# Altium schematic sheet ETHERNET.SchDoc
size 558 x 431 mm; SheetNumber: 17; SheetTotal: 25; Sheet_Name: Ethernet; Size: 11x17
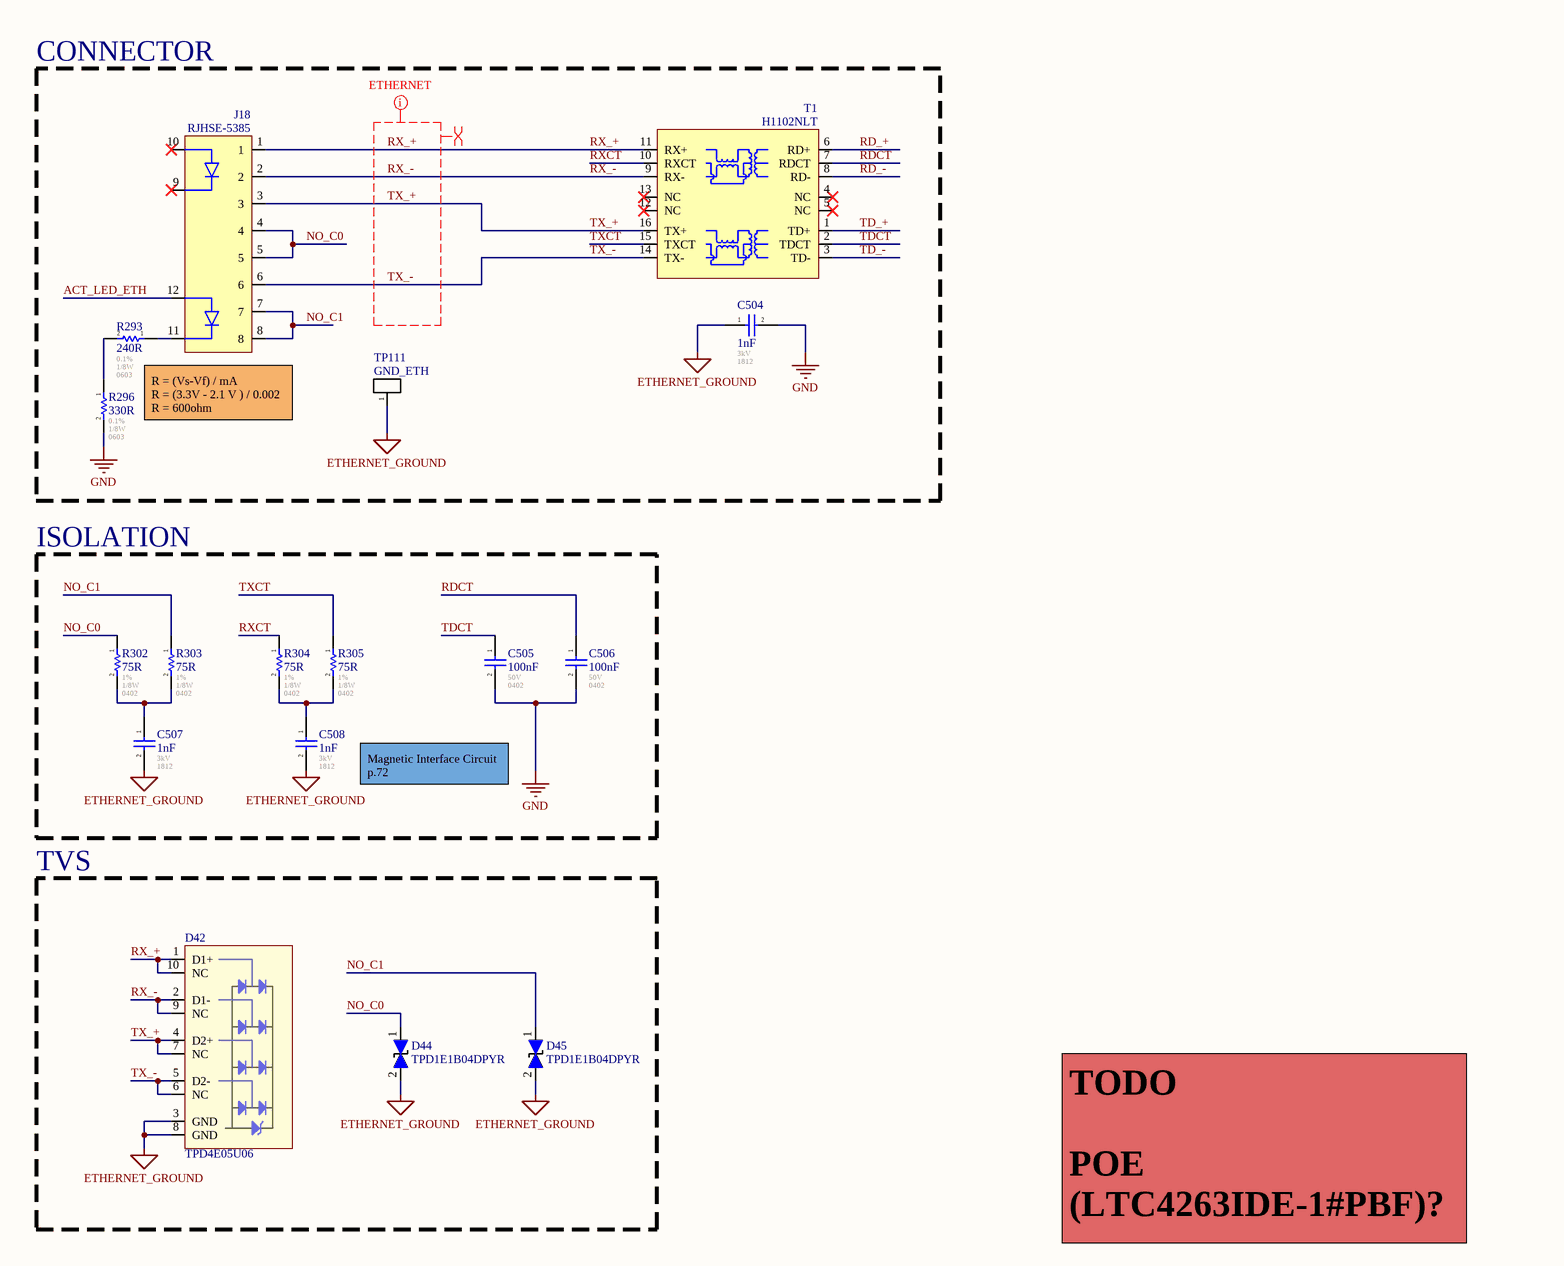
[diagram p0: ETHERNET.SchDoc, top left]
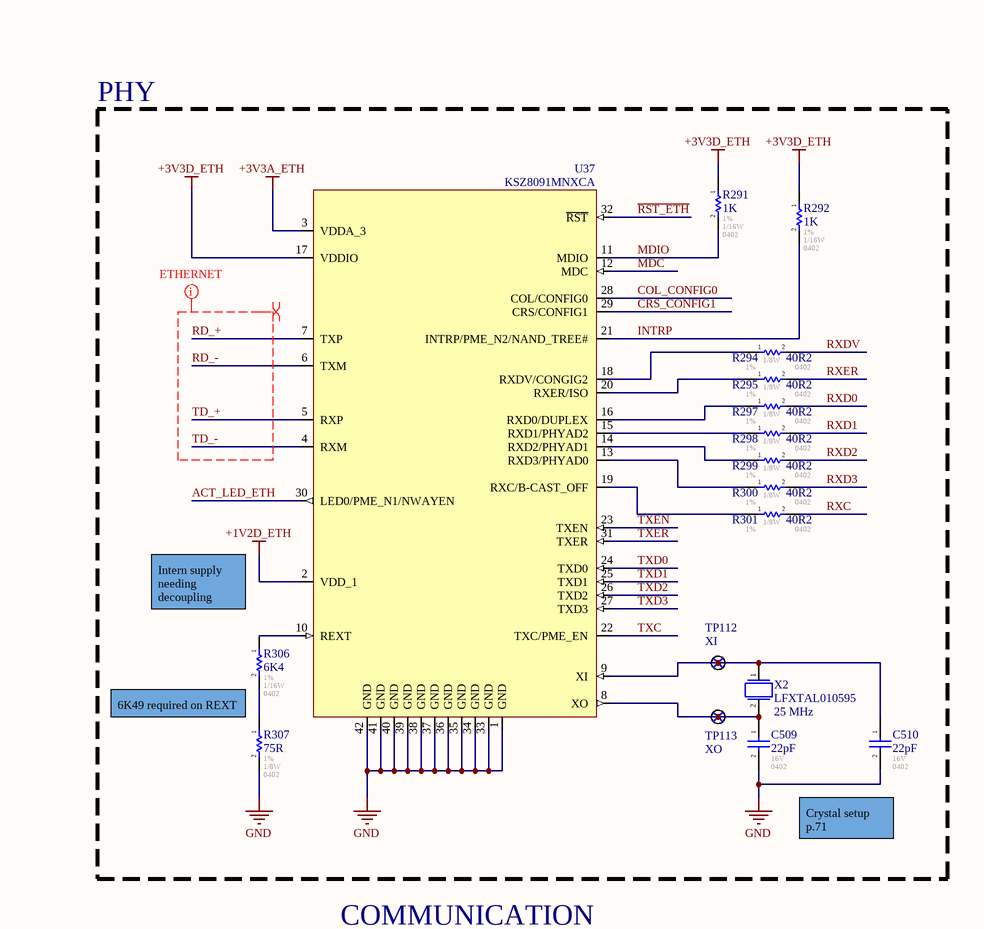
[diagram p1: ETHERNET.SchDoc, top right]
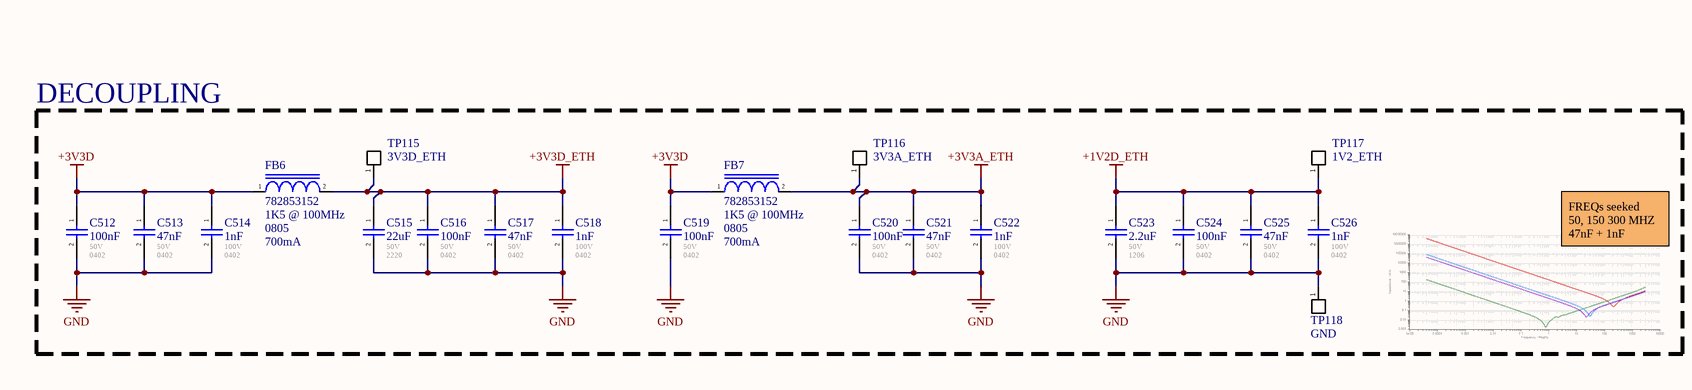
[diagram p2: ETHERNET.SchDoc, bottom left]
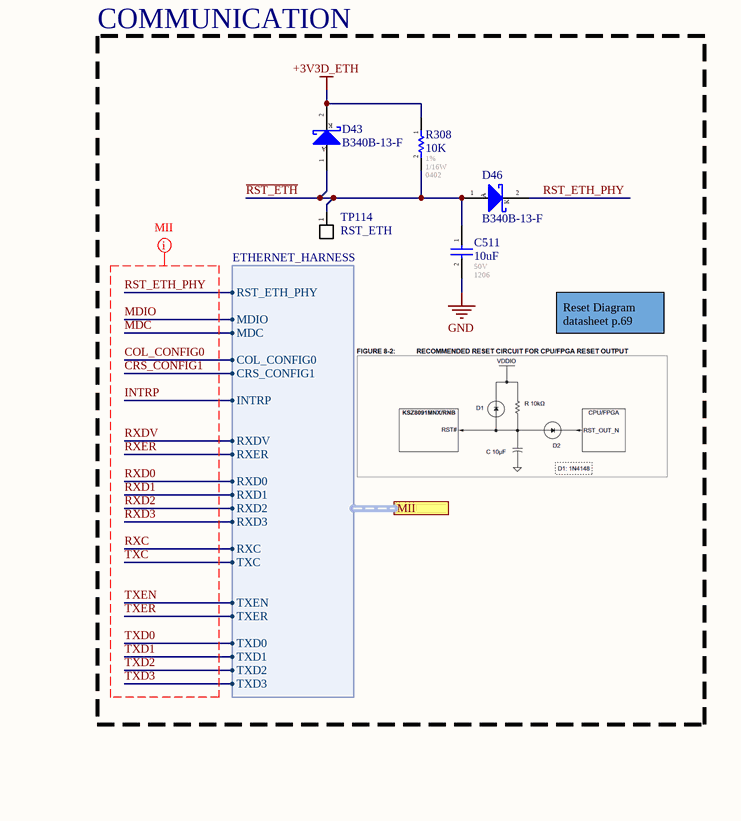
[diagram p3: ETHERNET.SchDoc, bottom right]

## Parts
C504  1nF  Voltage - Rated: 3kV  Footprint: 1812  [CAP_1812]
C505  100nF  Voltage - Rated: 50V  Footprint: 0402  [CAP_0402]
C506  100nF  Voltage - Rated: 50V  Footprint: 0402  [CAP_0402]
C507  1nF  Voltage - Rated: 3kV  Footprint: 1812  [CAP_1812]
C508  1nF  Voltage - Rated: 3kV  Footprint: 1812  [CAP_1812]
C509  22pF  Voltage - Rated: 16V  Footprint: 0402  [CAP_0402]
C510  22pF  Voltage - Rated: 16V  Footprint: 0402  [CAP_0402]
C511  10uF  Voltage - Rated: 50V  Footprint: 1206  [CAP_1206]
C512  100nF  Voltage - Rated: 50V  Footprint: 0402  [CAP_0402]
C513  47nF  Voltage - Rated: 50V  Footprint: 0402  [CAP_0402]
C514  1nF  Voltage - Rated: 100V  Footprint: 0402  [CAP_0402]
C515  22uF  Voltage - Rated: 50V  Footprint: 2220  [CAP_2220]
C516  100nF  Voltage - Rated: 50V  Footprint: 0402  [CAP_0402]
C517  47nF  Voltage - Rated: 50V  Footprint: 0402  [CAP_0402]
C518  1nF  Voltage - Rated: 100V  Footprint: 0402  [CAP_0402]
C519  100nF  Voltage - Rated: 50V  Footprint: 0402  [CAP_0402]
C520  100nF  Voltage - Rated: 50V  Footprint: 0402  [CAP_0402]
C521  47nF  Voltage - Rated: 50V  Footprint: 0402  [CAP_0402]
C522  1nF  Voltage - Rated: 100V  Footprint: 0402  [CAP_0402]
C523  2.2uF  Voltage - Rated: 50V  Footprint: 1206  [CAP_1206]
C524  100nF  Voltage - Rated: 50V  Footprint: 0402  [CAP_0402]
C525  47nF  Voltage - Rated: 50V  Footprint: 0402  [CAP_0402]
C526  1nF  Voltage - Rated: 100V  Footprint: 0402  [CAP_0402]
D42  TPD4E05U06  [TVS_DATA_TPD4E05U06]
D43  B340B-13-F  [DO214AA (SMB)]
D44  TPD1E1B04DPYR  [TVS_DATA_TPD1E1B04DPYR]
D45  TPD1E1B04DPYR  [TVS_DATA_TPD1E1B04DPYR]
D46  B340B-13-F  [DO214AA (SMB)]
FB6  782853152  Impedance @ Freq: 1K5 @ 100MHz  Package / Case: 0805  Current Rating: 700mA  [IND_0805]
FB7  782853152  Impedance @ Freq: 1K5 @ 100MHz  Package / Case: 0805  Current Rating: 700mA  [IND_0805]
J18  RJHSE-5385  [CONN_ETHERNET_RJHSE-5385]
R291  1K  Tolerance: 1%  Power: 1/16W  Package / Case: 0402  [RES_0402]
R292  1K  Tolerance: 1%  Power: 1/16W  Package / Case: 0402  [RES_0402]
R293  240R  Tolerance: 0.1%  Power: 1/8W  Package / Case: 0603  [RES_0603]
R294  40R2  Tolerance: 1%  Power: 1/8W  Package / Case: 0402  [RES_0402]
R295  40R2  Tolerance: 1%  Power: 1/8W  Package / Case: 0402  [RES_0402]
R296  330R  Tolerance: 0.1%  Power: 1/8W  Package / Case: 0603  [RES_0603]
R297  40R2  Tolerance: 1%  Power: 1/8W  Package / Case: 0402  [RES_0402]
R298  40R2  Tolerance: 1%  Power: 1/8W  Package / Case: 0402  [RES_0402]
R299  40R2  Tolerance: 1%  Power: 1/8W  Package / Case: 0402  [RES_0402]
R300  40R2  Tolerance: 1%  Power: 1/8W  Package / Case: 0402  [RES_0402]
R301  40R2  Tolerance: 1%  Power: 1/8W  Package / Case: 0402  [RES_0402]
R302  75R  Tolerance: 1%  Power: 1/8W  Package / Case: 0402  [RES_0402]
R303  75R  Tolerance: 1%  Power: 1/8W  Package / Case: 0402  [RES_0402]
R304  75R  Tolerance: 1%  Power: 1/8W  Package / Case: 0402  [RES_0402]
R305  75R  Tolerance: 1%  Power: 1/8W  Package / Case: 0402  [RES_0402]
R306  6K4  Tolerance: 1%  Power: 1/16W  Package / Case: 0402  [RES_0402]
R307  75R  Tolerance: 1%  Power: 1/8W  Package / Case: 0402  [RES_0402]
R308  10K  Tolerance: 1%  Power: 1/16W  Package / Case: 0402  [RES_0402]
T1  H1102NLT  [TRANSFO_H1102NLT]
TP111  GND_ETH  [TP_HOLE]  (no BOM)
TP112  XI  [TP_PAD_TINY]  (no BOM)
TP113  XO  [TP_PAD_TINY]  (no BOM)
TP114  RST_ETH  [TP_PAD]  (no BOM)
TP115  3V3D_ETH  [TP_PAD]  (no BOM)
TP116  3V3A_ETH  [TP_PAD]  (no BOM)
TP117  1V2_ETH  [TP_PAD]  (no BOM)
TP118  GND  [TP_PAD]  (no BOM)
U37  KSZ8091MNXCA  [COM_ETH_PHY_KSZ8091MNXCA]
X2  LFXTAL010595  Frequency: 25 MHz  [HC49_SMD]

## Blocks framed on the sheet
CONNECTOR: C504 J18 R293 R296 T1 TP111
PHY: C509 C510 R291 R292 R294 R295 R297-R301 R306 R307 TP112 TP113 U37 X2
ISOLATION: C505-C508 R302-R305
TVS: D42 D44 D45
COMMUNICATION: C511 D43 D46 R308 TP114
DECOUPLING: C512-C526 FB6 FB7 TP115-TP118

## Ports
MII (harness ETHERNET_HARNESS)

## Harnesses
ETHERNET_HARNESS: MDIO, MDC, COL_CONFIG0, CRS_CONFIG1, INTRP, RXDV, RXER, RXD0, RXD1, RXD2, RXD3, RXC, TXEN, TXER, TXD0, TXD1, TXD2, TXD3, TXC, RST_ETH_PHY

## Nets
+1V2D_ETH: C523.1 C524.1 C525.1 C526.1 TP117.1(A) U37.2(VDD_1)
+3V3A_ETH: C520.1 C521.1 C522.1 FB7.2 TP116.1(A) U37.3(VDDA_3)
+3V3D: C512.1 C513.1 C514.1 C519.1 FB6.1 FB7.1
+3V3D_ETH: C515.1 C516.1 C517.1 C518.1 D43.2(K) FB6.2 R291.1 R292.1 R308.1 TP115.1(A) U37.17(VDDIO)
ETHERNET_GROUND: C504.1 C507.2 C508.2 D42.3(GND) D42.8(GND) D44.2(i/o) D45.2(i/o) TP111.1(A)
GND: C504.2 C505.2 C506.2 C509.2 C510.2 C511.2 C512.2 C513.2 C514.2 C515.2 C516.2 C517.2 C518.2 C519.2 C520.2 C521.2 C522.2 C523.2 C524.2 C525.2 C526.2 R296.2 R307.2 TP118.1(A) U37.1(GND) U37.33(GND) U37.34(GND) U37.35(GND) U37.36(GND) U37.37(GND) U37.38(GND) U37.39(GND) U37.40(GND) U37.41(GND) U37.42(GND)
~{RST_ETH}: C511.1 D43.1(A) D46.1(A) R308.2 TP114.1(A) U37.32(~{RST})
ACT_LED_ETH: J18.12(LED2_A) U37.30(LED0/PME_N1/NWAYEN)
COL_CONFIG0: U37.28(COL/CONFIG0) ; port MII.COL_CONFIG0
CRS_CONFIG1: U37.29(CRS/CONFIG1) ; port MII.CRS_CONFIG1
INTRP: R292.2 U37.21(INTRP/PME_N2/NAND_TREE#) ; port MII.INTRP
MDC: U37.12(MDC) ; port MII.MDC
MDIO: R291.2 U37.11(MDIO) ; port MII.MDIO
NO_C0: D44.1(i/o) J18.4 J18.5 R302.1
NO_C1: D45.1(i/o) J18.7 J18.8 R303.1
RD_+: T1.6(RD+) U37.7(TXP)
RD_-: T1.8(RD-) U37.6(TXM)
RDCT: C506.1 T1.7(RDCT)
RST_ETH_PHY: D46.2(K) ; port MII.RST_ETH_PHY
RX_+: D42.1(D1+) D42.10(NC) J18.1 T1.11(RX+)
RX_-: D42.2(D1-) D42.9(NC) J18.2 T1.9(RX-)
RXC: R301.2 ; port MII.RXC
RXCT: R304.1 T1.10(RXCT)
RXD0: R297.2 ; port MII.RXD0
RXD1: R298.2 ; port MII.RXD1
RXD2: R299.2 ; port MII.RXD2
RXD3: R300.2 ; port MII.RXD3
RXDV: R294.2 ; port MII.RXDV
RXER: R295.2 ; port MII.RXER
TD_+: T1.1(TD+) U37.5(RXP)
TD_-: T1.3(TD-) U37.4(RXM)
TDCT: C505.1 T1.2(TDCT)
TX_+: D42.4(D2+) D42.7(NC) J18.3 T1.16(TX+)
TX_-: D42.5(D2-) D42.6(NC) J18.6 T1.14(TX-)
TXC: U37.22(TXC/PME_EN) ; port MII.TXC
TXCT: R305.1 T1.15(TXCT)
TXD0: U37.24(TXD0) ; port MII.TXD0
TXD1: U37.25(TXD1) ; port MII.TXD1
TXD2: U37.26(TXD2) ; port MII.TXD2
TXD3: U37.27(TXD3) ; port MII.TXD3
TXEN: U37.23(TXEN) ; port MII.TXEN
TXER: U37.31(TXER) ; port MII.TXER
NetC507_1: C507.1 R302.2 R303.2
NetC508_1: C508.1 R304.2 R305.2
NetC509_1: C509.1 TP113.1(A) U37.8(XO) X2.2
NetC510_1: C510.1 TP112.1(A) U37.9(XI) X2.1
NetJ18_11: J18.11(LED2_K) R293.1
NetR293_2: R293.2 R296.1
NetR294_1: R294.1 U37.18(RXDV/CONGIG2)
NetR295_1: R295.1 U37.20(RXER/ISO)
NetR297_1: R297.1 U37.16(RXD0/DUPLEX)
NetR298_1: R298.1 U37.15(RXD1/PHYAD2)
NetR299_1: R299.1 U37.14(RXD2/PHYAD1)
NetR300_1: R300.1 U37.13(RXD3/PHYAD0)
NetR301_1: R301.1 U37.19(RXC/B-CAST_OFF)
NetR306_1: R306.1 U37.10(REXT)
NetR306_2: R306.2 R307.1

Not connected (* = marked no-connect by the designer): J18 9(LED1_K)* 10(LED1_A)*; T1 4(NC)* 5(NC)* 12(NC)* 13(NC)*

## Layout directives
differential pair: RD_+, RD_-, RX_+, RX_-, TD_+, TD_-, TX_+, TX_-
net class ETHERNET: RD_+, RD_-, RX_+, RX_-, TD_+, TD_-, TX_+, TX_-
net class MII; net class S50: COL_CONFIG0, CRS_CONFIG1, INTRP, MDC, MDIO, RST_ETH_PHY, RXC, RXD0, RXD1, RXD2, RXD3, RXDV, RXER, TXC, TXD0, TXD1, TXD2, TXD3, TXEN, TXER

## Notes on the sheet
- R = (Vs-Vf) / mA
  R = (3.3V - 2.1 V ) / 0.002
  R = 600ohm
- Intern supply needing decoupling
- 6K49 required on REXT
- Magnetic Interface Circuit
  p.72
- Crystal setup
  p.71
- TODO
  POE
  (LTC4263IDE-1#PBF)?
- Reset Diagram
  datasheet p.69
- FREQs seeked
  50, 150 300 MHZ
  47nF + 1nF
- Sheet Name
- Project Title
- Global Project
- Revision
- Size
- Date
- Group
- Sheet
- of
- Filename
- Designers

## Library data of the parts
C504 C507 C508 = CAP_CER: C1812C102KHRACAUTO / 0402 470pF 10% X7R Ceramic Capacitor; Mfr: KEMET; Operating Temperature: -55C - 125C; Temperature Coefficient: X7R; ComponentLink1Description: Digikey; ComponentLink1URL: https://www.digikey.com/en/products/detail/kemet/C1812C102KHRACAUTO/8109956; Part#: C1812C102KHRACAUTO; ComponentLink2Description: Datasheet; ComponentLink2URL: https://connect.kemet.com:7667/gateway/IntelliData-ComponentDocumentation/1.0/download/datasheet/C1812C102KHRACAUTO; Tolerance: 10%; Ratings: AEC-Q200; ComponentLink3Description: KEMET; ComponentLink3URL: https://www.kemet.com/en/us/capacitors/ceramic/product/C1812C102KHRACAUTO.html; ComponentLink4Description: Octopart; ComponentLink4URL: https://octopart.com/c1812c102khracauto-kemet-67309371?r=sp; Features: Low ESL, High Voltage; Supplier 1: Mouser; Supplier Part Number 1: 80-C1812C102KHRAUTO
C505 C506 C512 C516 C519 C520 C524 = CAP_CER: GCM155R71H104KE02J / 0402 100nF 10% X7R Ceramic Capacitor; Mfr: Murata; Operating Temperature: -55C - 125C; Temperature Coefficient: X7R; ComponentLink1Description: Digikey; ComponentLink1URL: [Digikey Link]; Part#: GCM155R71H104KE02J; ComponentLink2Description: Datasheet; ComponentLink2URL: [Datasheet Link]; Tolerance: 10%; Ratings: AEC-Q200
C509 C510 = CAP_CER: 0402 22pF X7R Ceramic Capacitor / C0402C220K4RACAUTO; Operating Temperature: *; Temperature Coefficient: X7R; Mfr: *; ComponentLink1Description: Digikey; ComponentLink1URL: [Digikey Link]; Digikey Part No: *; ComponentLink2Description: Datasheet; ComponentLink2URL: [Datasheet Link]
C511 = CAP_CER: GRT31CR61H106KE01L / 1206 10uF 10% X5R Ceramic Capacitor; Mfr: Murata; Operating Temperature: -55C - 85C; Temperature Coefficient: X5R; ComponentLink1Description: Digikey; ComponentLink1URL: [Digikey Link]; ComponentLink2Description: Datasheet; ComponentLink2URL: [Datasheet Link]; Tolerance: 10%; Ratings: AEC-Q200; Part#: GRT31CR61H106KE01L
C513 C517 C521 C525 = CAP_CER: GCM155R71H473KE02J / 0402 47nF 10% X7R Ceramic Capacitor; Mfr: Murata; Operating Temperature: -55C - 125C; Temperature Coefficient: X7R; ComponentLink1Description: Digikey; ComponentLink1URL: [Digikey Link]; Part#: GCM155R71H473KE02J; ComponentLink2Description: Datasheet; ComponentLink2URL: [Datasheet Link]; Tolerance: 10%; Ratings: AEC-Q200
C514 C518 C522 C526 = CAP_CER: GCM155R72A102KA37D / 0402 1nF 10% X7R Ceramic Capacitor; Mfr: Murata; Operating Temperature: -55C - 125C; Temperature Coefficient: X7R; ComponentLink1Description: Digikey; ComponentLink1URL: [Digikey Link]; Part#: GCM155R72A102KA37D; ComponentLink2Description: Datasheet; ComponentLink2URL: [Datasheet Link]; Tolerance: 10%; Ratings: AEC-Q200
C515 = CAP_CER: CGA9P3X7R1H226M250KB / 2220 22uF 20% X7R Ceramic Capacitor; Mfr: TDK; Operating Temperature: -55C - 125C; Temperature Coefficient: X7R; ComponentLink1Description: Digikey; ComponentLink1URL: https://www.digikey.ca/en/products/detail/tdk-corporation/CGA9P3X7R1H226M250KB/10240627; ComponentLink2Description: Datasheet; ComponentLink2URL: https://product.tdk.com/system/files/dam/doc/product/capacitor/ceramic/mlcc/charasheet/cga9p3x7r1h226m250kb.pdf; Tolerance: 20%; Ratings: AEC-Q200; Part#: CGA9P3X7R1H226M250KB; Supplier 1: Arrow Electronics; Supplier Part Number 1: CGA9P3X7R1H226M250KB; ComponentLink3Description: TDK; ComponentLink3URL: https://product.tdk.com/en/search/capacitor/ceramic/mlcc/info?part_no=CGA9P3X7R1H226M250KB; ComponentLink4Description: Octopart; ComponentLink4URL: https://octopart.com/cga9p3x7r1h226m250kb-tdk-102764996?r=sp
C523 = CAP_CER: GRT31CR71H225KE13L / 1206 2.2uF 10% X7R Ceramic Capacitor; Mfr: Murata; Operating Temperature: -55C - 125C; Temperature Coefficient: X7R; ComponentLink1Description: Digikey; ComponentLink1URL: https://www.digikey.ca/en/products/detail/murata-electronics/GRT31CR71H225KE13L/10700891; Part#: GRT31CR71H225KE13L; ComponentLink2Description: Datasheet; ComponentLink2URL: https://search.murata.co.jp/Ceramy/image/img/A01X/G101/ENG/GRT31CR71H225KE13-01A.pdf; ComponentLink3Description: Octopart; ComponentLink3URL: https://octopart.com/grt31cr71h225ke13l-murata-76584457?r=sp; ComponentLink4Description: Murata; ComponentLink4URL: https://www.murata.com/en-us/products/productdetail?partno=GRT31CR71H225KE13%23; Tolerance: 10%; Ratings: AEC-Q200
D42 = TVS_DATA_TPD4E05U06: TVS - TVS DIODE 5.5VWM 14VC - 10SON; Manufacturer #1: Texas Instruments; Part Number #1: TPD4E05U06DQAR; Current Rating: 2.5A (8/20µs); Power Max: 40 W (peak); Value: 4 unidirectionnal channels; Voltage rating: 6V (Breakdown); Polarized: YES; Magnetic Material: UNKNOWN; GRAMS Lib Spec: 2.8; Manufacturer #2: *; Part Number #2: *; HelpURL: http://www.ti.com/lit/ds/symlink/tpd4e05u06.pdf; Supplier 1: Digi-Key; Supplier Part Number 1: 296-35765-1-ND; Note: *; Assembly Type: SMD; Temperature: -40°C ~ 125°C; Package: 10-USON; CreatedBy/Date: Olivier Bernard / 12/3/2018; Tolerance: *; VerifiedBy: Caroline Paulin / 4 juillet 2018; Cryo: UNKNOWN
D43 D46 = DIODE_SHOTTKEY: VS-15MQ040HM3/5AT; Diode Type: Schottky; Current: 1.5A; Reverse Voltage: 40V; Forward Voltage: 430mV @ 1.5A; Qualification: AEC-Q101; Package / Case: SMA; ComponentLink1Description: Digikey; ComponentLink1URL: https://www.digikey.ca/en/products/detail/diodes-incorporated/B340B-13-F/768869; ComponentLink2Description: Octopart; ComponentLink2URL: https://octopart.com/b340b-13-f-diodes+inc.-325817?r=sp
D44 D45 = TVS_DATA_TPD1E1B04DPYR: TVS - TVS DIODE 3.6V 8.5V - 0402; Manufacturer #1: Texas Instruments; Current Rating: 6.3Apeak; Power Max: 50Wpeak; GRAMS Lib Spec: 2.8; Magnetic Material: Unknown; Polarized: No; Value: *; Tolerance: *; Voltage Rating: 3.6V; HelpURL: http://www.ti.com/lit/ds/symlink/tpd1e1b04.pdf; CreatedBy/Date: Keven Deslandes - 2018/10/19; VerifiedBy: Caroline Paulin - 28 janv 2019; Temperature: -40°C ~ 125°C (TA); Package: 0402; Manufacturer #2: *; Note: *; Assembly Type: SMD; Part Number #2: *; Part Number #1: TPD1E1B04DPYR; Supplier 1: Digi-Key; Supplier Part Number 1: 296-47364-1-ND; Cryo: UNKNOWN
FB6 FB7 = FERRITE_BEAD: 600 Ohms @ 100 MHz 1 Signal Line Ferrite Bead 0603 (1608 Metric) 1A 200mOhm; Manufacturer: Wurth Elektronik; Resistance: 350mR; Operating Temperature: -55C - 125C; Rating: AEC-Q200; ComponentLink1Description: Digikey; ComponentLink1URL: https://www.digikey.ca/en/products/detail/w%C3%BCrth-elektronik/782853152/5168812; ComponentLink3Description: Octopart; ComponentLink3URL: https://octopart.com/782853152-wurth+elektronik-56466774?r=sp; ComponentLink5Description: Datasheet; ComponentLink5URL: https://www.we-online.com/en/components/products/datasheet/782853152.pdf
J18 = CONN_ETHERNET_RJHSE-5385: CONN - MOD JACK RJ45 R/A ETHERNET - TH; Mfg: Amphenol; Voltage: *; Current: *; Power: *; Mfg Part Number: RJHSE-5385; HelpURL: https://www.amphenolcanada.com/ProductSearch/drawings/AC/RJHSE538X.pdf; CreatedBy: Jonathan Bouchard; Temperature: -55°C ~ 85°C; Value: *; Precision: *; Package: TH-12; Supplier 1: Digikey; Supplier Part Number 1: RJHSE-5385-ND
R291-R295 R297-R308 = RESISTOR: Automotive: AEC-Q200; Operating Temperature: *; # Digikey: *; ComponentLink1Description: Digikey; ComponentLink1URL: *; # Manufacturer: *
R296 = RESISTOR: 1M 0603 1% 1/16W Resistor; Automotive: AEC-Q200; Operating Temperature: *; # Digikey: *; ComponentLink1Description: Digikey; ComponentLink1URL: *; # Manufacturer: *
T1 = TRANSFO_H1102NLT: TRANSFO - ETHERNET 10/100B-TX - SMD-16; Mfg: Pulse Eng.; Value: 1:1 (350uH); Voltage: *; Current: *; Power: *; Mfg Part Number: H1102NLT; HelpURL: http://media.digikey.com/pdf/Data%20Sheets/Pulse%20PDFs/10_100BASE-T%20Single%20Port%20SMD%20Magnetics_Rev2008.pdf; CreatedBy: Jonathan Bouchard; Temperature: -40°C to 85°C; Precision: *; Package: SMD-16; Supplier 1: Digikey; Supplier Part Number 1: 553-1532-1-ND
TP111 = TESTPOINT: Test Point; ClassName: Testpoint
TP112 TP113 = TESTPOINT_PAD_TINY: Test Point
TP114-TP118 = TESTPOINT_PAD: Test Point
U37 = COM_ETH_PHY_KSZ8091MNXCA: COM - ETHERNET PHY 10/100 - QFN-32; Voltage: 1.8V, 2.5V, 3.3V; Mfg: Micrel; Current: *; Power: *; Mfg Part Number: KSZ8091MNXCA; HelpURL: http://ww1.microchip.com/downloads/en/DeviceDoc/00002275A.pdf; CreatedBy: Jonathan Bouchard; Temperature: 0°C ~ 70°C; Value: *; Precision: *; Package: QFN-32; Supplier 1: Digikey; Supplier Part Number 1: 576-4356-ND
X2 = OSCILLATOR: 25 MHz ±30ppm Crystal 16pF 40 Ohms HC-49/US; Frequency Stability: 50ppm; Frequency Tolerance: 30ppm; Load Capacitance: 16pF; Operating Temperature: -10C - 60C; Rating: *; Type: *; ComponentLink1Description: Digikey; ComponentLink1URL: https://www.digikey.ca/en/products/detail/iqd-frequency-products/LFXTAL010595/8633762; ComponentLink2Description: Datasheet; ComponentLink2URL: https://www.iqdfrequencyproducts.com/products/datasheets/LFXTAL010595.pdf; ComponentLink3Description: Octopart; ComponentLink3URL: https://octopart.com/lfxtal010595-iqd+frequency+products-8426629; Supplier 1: Newark; Supplier Part Number 1: 94X0915